# EasyEDA Pro project ProPrj_电容计量V2_2026-06-24.epro, schematic 贴片电容2
Board Name: 贴片电容2; Create Date: 2026-04-20; Page Name: P1; Project Name: 电容计量V2; Schematic Name: 贴片电容2; Update Date: 2026-04-20; Page Size: A4; Version: V1.0
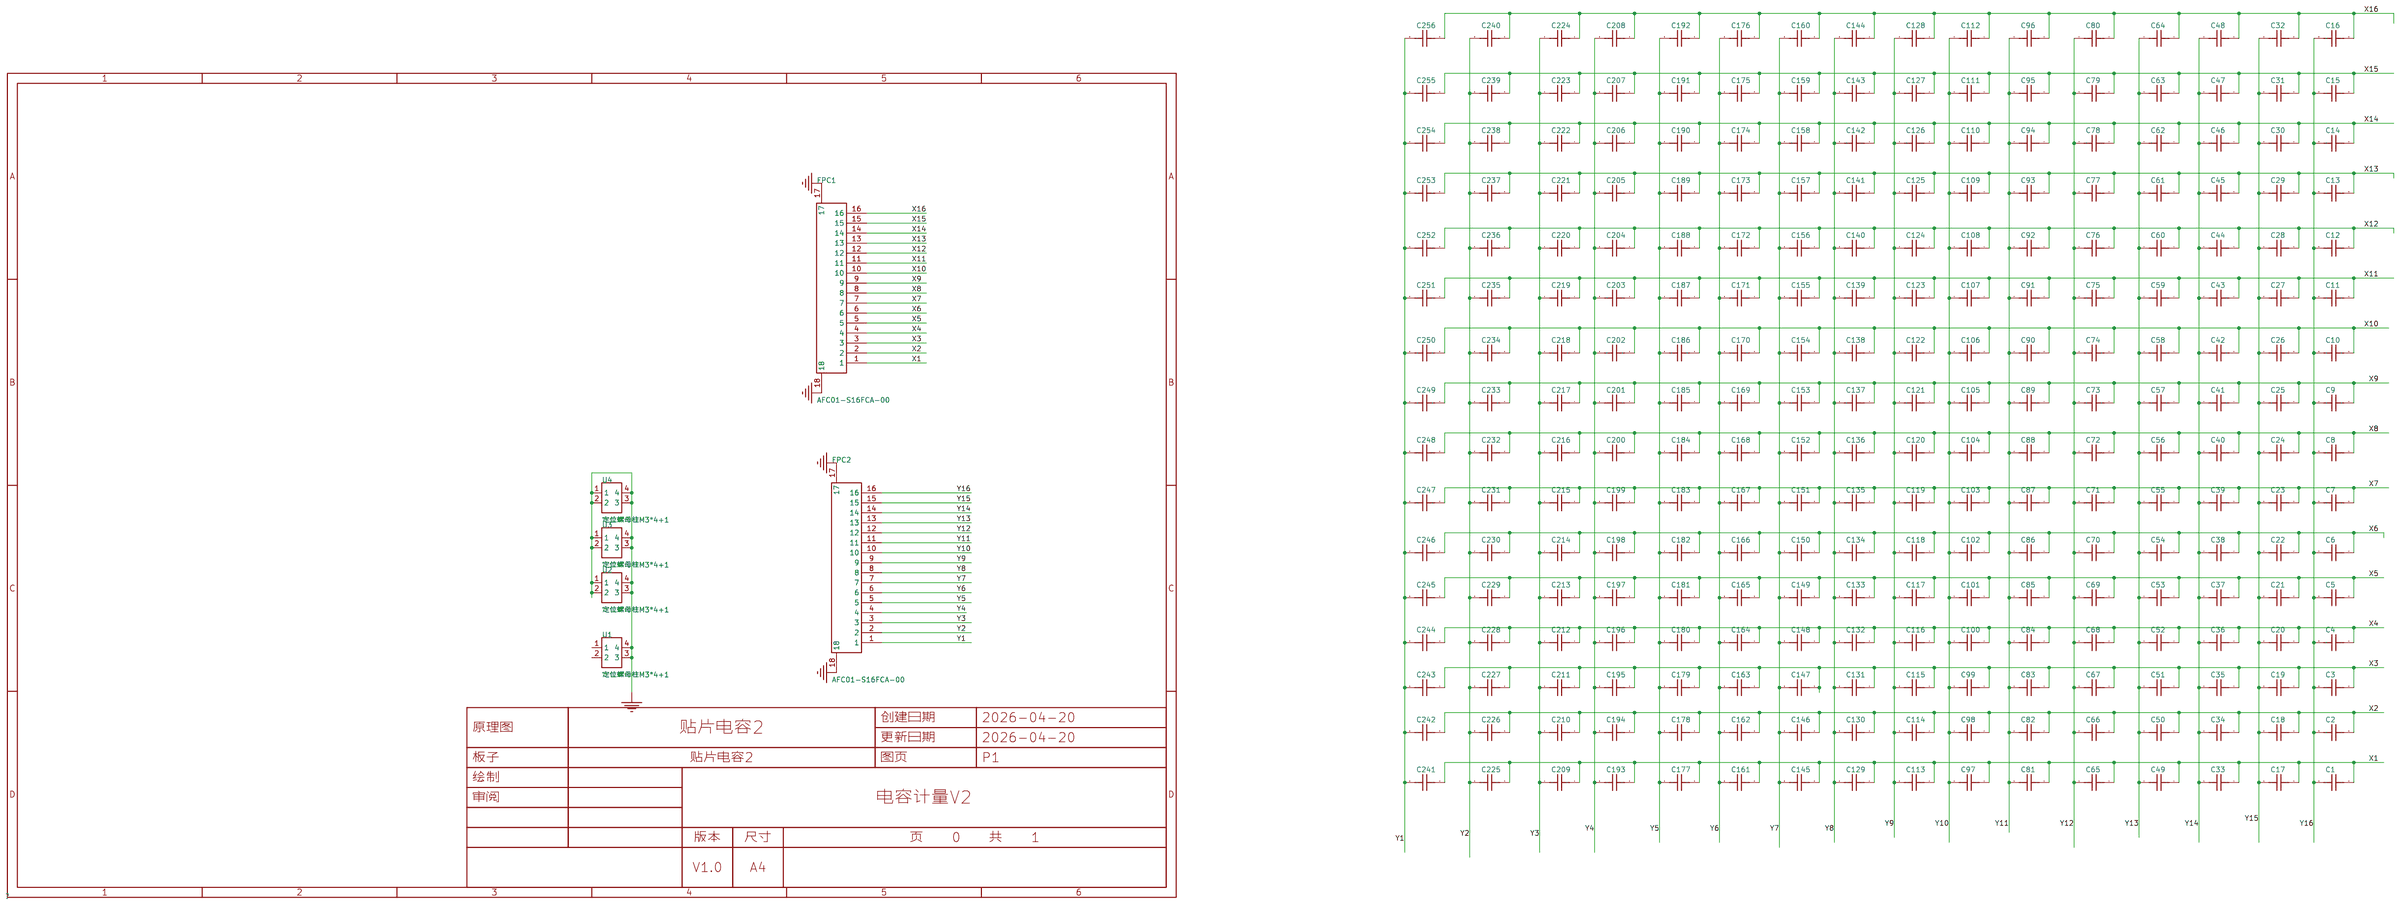
[diagram p10: schematic sheet]

## Parts
C1  C1608X6S1C225KTJ00E  [C0603]
C2  C1608X6S1C225KTJ00E  [C0603]
C3  C1608X6S1C225KTJ00E  [C0603]
C4  C1608X6S1C225KTJ00E  [C0603]
C5  C1608X6S1C225KTJ00E  [C0603]
C6  C1608X6S1C225KTJ00E  [C0603]
C7  C1608X6S1C225KTJ00E  [C0603]
C8  C1608X6S1C225KTJ00E  [C0603]
C9  C1608X6S1C225KTJ00E  [C0603]
C10  C1608X6S1C225KTJ00E  [C0603]
C11  C1608X6S1C225KTJ00E  [C0603]
C12  C1608X6S1C225KTJ00E  [C0603]
C13  C1608X6S1C225KTJ00E  [C0603]
C14  C1608X6S1C225KTJ00E  [C0603]
C15  C1608X6S1C225KTJ00E  [C0603]
C16  C1608X6S1C225KTJ00E  [C0603]
C17  C1608X6S1C225KTJ00E  [C0603]
C18  C1608X6S1C225KTJ00E  [C0603]
C19  C1608X6S1C225KTJ00E  [C0603]
C20  C1608X6S1C225KTJ00E  [C0603]
C21  C1608X6S1C225KTJ00E  [C0603]
C22  C1608X6S1C225KTJ00E  [C0603]
C23  C1608X6S1C225KTJ00E  [C0603]
C24  C1608X6S1C225KTJ00E  [C0603]
C25  C1608X6S1C225KTJ00E  [C0603]
C26  C1608X6S1C225KTJ00E  [C0603]
C27  C1608X6S1C225KTJ00E  [C0603]
C28  C1608X6S1C225KTJ00E  [C0603]
C29  C1608X6S1C225KTJ00E  [C0603]
C30  C1608X6S1C225KTJ00E  [C0603]
C31  C1608X6S1C225KTJ00E  [C0603]
C32  C1608X6S1C225KTJ00E  [C0603]
C33  C1608X6S1C225KTJ00E  [C0603]
C34  C1608X6S1C225KTJ00E  [C0603]
C35  C1608X6S1C225KTJ00E  [C0603]
C36  C1608X6S1C225KTJ00E  [C0603]
C37  C1608X6S1C225KTJ00E  [C0603]
C38  C1608X6S1C225KTJ00E  [C0603]
C39  C1608X6S1C225KTJ00E  [C0603]
C40  C1608X6S1C225KTJ00E  [C0603]
C41  C1608X6S1C225KTJ00E  [C0603]
C42  C1608X6S1C225KTJ00E  [C0603]
C43  C1608X6S1C225KTJ00E  [C0603]
C44  C1608X6S1C225KTJ00E  [C0603]
C45  C1608X6S1C225KTJ00E  [C0603]
C46  C1608X6S1C225KTJ00E  [C0603]
C47  C1608X6S1C225KTJ00E  [C0603]
C48  C1608X6S1C225KTJ00E  [C0603]
C49  C1608X6S1C225KTJ00E  [C0603]
C50  C1608X6S1C225KTJ00E  [C0603]
C51  C1608X6S1C225KTJ00E  [C0603]
C52  C1608X6S1C225KTJ00E  [C0603]
C53  C1608X6S1C225KTJ00E  [C0603]
C54  C1608X6S1C225KTJ00E  [C0603]
C55  C1608X6S1C225KTJ00E  [C0603]
C56  C1608X6S1C225KTJ00E  [C0603]
C57  C1608X6S1C225KTJ00E  [C0603]
C58  C1608X6S1C225KTJ00E  [C0603]
C59  C1608X6S1C225KTJ00E  [C0603]
C60  C1608X6S1C225KTJ00E  [C0603]
C61  C1608X6S1C225KTJ00E  [C0603]
C62  C1608X6S1C225KTJ00E  [C0603]
C63  C1608X6S1C225KTJ00E  [C0603]
C64  C1608X6S1C225KTJ00E  [C0603]
C65  C1608X6S1C225KTJ00E  [C0603]
C66  C1608X6S1C225KTJ00E  [C0603]
C67  C1608X6S1C225KTJ00E  [C0603]
C68  C1608X6S1C225KTJ00E  [C0603]
C69  C1608X6S1C225KTJ00E  [C0603]
C70  C1608X6S1C225KTJ00E  [C0603]
C71  C1608X6S1C225KTJ00E  [C0603]
C72  C1608X6S1C225KTJ00E  [C0603]
C73  C1608X6S1C225KTJ00E  [C0603]
C74  C1608X6S1C225KTJ00E  [C0603]
C75  C1608X6S1C225KTJ00E  [C0603]
C76  C1608X6S1C225KTJ00E  [C0603]
C77  C1608X6S1C225KTJ00E  [C0603]
C78  C1608X6S1C225KTJ00E  [C0603]
C79  C1608X6S1C225KTJ00E  [C0603]
C80  C1608X6S1C225KTJ00E  [C0603]
C81  C1608X6S1C225KTJ00E  [C0603]
C82  C1608X6S1C225KTJ00E  [C0603]
C83  C1608X6S1C225KTJ00E  [C0603]
C84  C1608X6S1C225KTJ00E  [C0603]
C85  C1608X6S1C225KTJ00E  [C0603]
C86  C1608X6S1C225KTJ00E  [C0603]
C87  C1608X6S1C225KTJ00E  [C0603]
C88  C1608X6S1C225KTJ00E  [C0603]
C89  C1608X6S1C225KTJ00E  [C0603]
C90  C1608X6S1C225KTJ00E  [C0603]
C91  C1608X6S1C225KTJ00E  [C0603]
C92  C1608X6S1C225KTJ00E  [C0603]
C93  C1608X6S1C225KTJ00E  [C0603]
C94  C1608X6S1C225KTJ00E  [C0603]
C95  C1608X6S1C225KTJ00E  [C0603]
C96  C1608X6S1C225KTJ00E  [C0603]
C97  C1608X6S1C225KTJ00E  [C0603]
C98  C1608X6S1C225KTJ00E  [C0603]
C99  C1608X6S1C225KTJ00E  [C0603]
C100  C1608X6S1C225KTJ00E  [C0603]
C101  C1608X6S1C225KTJ00E  [C0603]
C102  C1608X6S1C225KTJ00E  [C0603]
C103  C1608X6S1C225KTJ00E  [C0603]
C104  C1608X6S1C225KTJ00E  [C0603]
C105  C1608X6S1C225KTJ00E  [C0603]
C106  C1608X6S1C225KTJ00E  [C0603]
C107  C1608X6S1C225KTJ00E  [C0603]
C108  C1608X6S1C225KTJ00E  [C0603]
C109  C1608X6S1C225KTJ00E  [C0603]
C110  C1608X6S1C225KTJ00E  [C0603]
C111  C1608X6S1C225KTJ00E  [C0603]
C112  C1608X6S1C225KTJ00E  [C0603]
C113  C1608X6S1C225KTJ00E  [C0603]
C114  C1608X6S1C225KTJ00E  [C0603]
C115  C1608X6S1C225KTJ00E  [C0603]
C116  C1608X6S1C225KTJ00E  [C0603]
C117  C1608X6S1C225KTJ00E  [C0603]
C118  C1608X6S1C225KTJ00E  [C0603]
C119  C1608X6S1C225KTJ00E  [C0603]
C120  C1608X6S1C225KTJ00E  [C0603]
C121  C1608X6S1C225KTJ00E  [C0603]
C122  C1608X6S1C225KTJ00E  [C0603]
C123  C1608X6S1C225KTJ00E  [C0603]
C124  C1608X6S1C225KTJ00E  [C0603]
C125  C1608X6S1C225KTJ00E  [C0603]
C126  C1608X6S1C225KTJ00E  [C0603]
C127  C1608X6S1C225KTJ00E  [C0603]
C128  C1608X6S1C225KTJ00E  [C0603]
C129  C1608X6S1C225KTJ00E  [C0603]
C130  C1608X6S1C225KTJ00E  [C0603]
C131  C1608X6S1C225KTJ00E  [C0603]
C132  C1608X6S1C225KTJ00E  [C0603]
C133  C1608X6S1C225KTJ00E  [C0603]
C134  C1608X6S1C225KTJ00E  [C0603]
C135  C1608X6S1C225KTJ00E  [C0603]
C136  C1608X6S1C225KTJ00E  [C0603]
C137  C1608X6S1C225KTJ00E  [C0603]
C138  C1608X6S1C225KTJ00E  [C0603]
C139  C1608X6S1C225KTJ00E  [C0603]
C140  C1608X6S1C225KTJ00E  [C0603]
C141  C1608X6S1C225KTJ00E  [C0603]
C142  C1608X6S1C225KTJ00E  [C0603]
C143  C1608X6S1C225KTJ00E  [C0603]
C144  C1608X6S1C225KTJ00E  [C0603]
C145  C1608X6S1C225KTJ00E  [C0603]
C146  C1608X6S1C225KTJ00E  [C0603]
C147  C1608X6S1C225KTJ00E  [C0603]
C148  C1608X6S1C225KTJ00E  [C0603]
C149  C1608X6S1C225KTJ00E  [C0603]
C150  C1608X6S1C225KTJ00E  [C0603]
C151  C1608X6S1C225KTJ00E  [C0603]
C152  C1608X6S1C225KTJ00E  [C0603]
C153  C1608X6S1C225KTJ00E  [C0603]
C154  C1608X6S1C225KTJ00E  [C0603]
C155  C1608X6S1C225KTJ00E  [C0603]
C156  C1608X6S1C225KTJ00E  [C0603]
C157  C1608X6S1C225KTJ00E  [C0603]
C158  C1608X6S1C225KTJ00E  [C0603]
C159  C1608X6S1C225KTJ00E  [C0603]
C160  C1608X6S1C225KTJ00E  [C0603]
C161  C1608X6S1C225KTJ00E  [C0603]
C162  C1608X6S1C225KTJ00E  [C0603]
C163  C1608X6S1C225KTJ00E  [C0603]
C164  C1608X6S1C225KTJ00E  [C0603]
C165  C1608X6S1C225KTJ00E  [C0603]
C166  C1608X6S1C225KTJ00E  [C0603]
C167  C1608X6S1C225KTJ00E  [C0603]
C168  C1608X6S1C225KTJ00E  [C0603]
C169  C1608X6S1C225KTJ00E  [C0603]
C170  C1608X6S1C225KTJ00E  [C0603]
C171  C1608X6S1C225KTJ00E  [C0603]
C172  C1608X6S1C225KTJ00E  [C0603]
C173  C1608X6S1C225KTJ00E  [C0603]
C174  C1608X6S1C225KTJ00E  [C0603]
C175  C1608X6S1C225KTJ00E  [C0603]
C176  C1608X6S1C225KTJ00E  [C0603]
C177  C1608X6S1C225KTJ00E  [C0603]
C178  C1608X6S1C225KTJ00E  [C0603]
C179  C1608X6S1C225KTJ00E  [C0603]
C180  C1608X6S1C225KTJ00E  [C0603]
C181  C1608X6S1C225KTJ00E  [C0603]
C182  C1608X6S1C225KTJ00E  [C0603]
C183  C1608X6S1C225KTJ00E  [C0603]
C184  C1608X6S1C225KTJ00E  [C0603]
C185  C1608X6S1C225KTJ00E  [C0603]
C186  C1608X6S1C225KTJ00E  [C0603]
C187  C1608X6S1C225KTJ00E  [C0603]
C188  C1608X6S1C225KTJ00E  [C0603]
C189  C1608X6S1C225KTJ00E  [C0603]
C190  C1608X6S1C225KTJ00E  [C0603]
C191  C1608X6S1C225KTJ00E  [C0603]
C192  C1608X6S1C225KTJ00E  [C0603]
C193  C1608X6S1C225KTJ00E  [C0603]
C194  C1608X6S1C225KTJ00E  [C0603]
C195  C1608X6S1C225KTJ00E  [C0603]
C196  C1608X6S1C225KTJ00E  [C0603]
C197  C1608X6S1C225KTJ00E  [C0603]
C198  C1608X6S1C225KTJ00E  [C0603]
C199  C1608X6S1C225KTJ00E  [C0603]
C200  C1608X6S1C225KTJ00E  [C0603]
C201  C1608X6S1C225KTJ00E  [C0603]
C202  C1608X6S1C225KTJ00E  [C0603]
C203  C1608X6S1C225KTJ00E  [C0603]
C204  C1608X6S1C225KTJ00E  [C0603]
C205  C1608X6S1C225KTJ00E  [C0603]
C206  C1608X6S1C225KTJ00E  [C0603]
C207  C1608X6S1C225KTJ00E  [C0603]
C208  C1608X6S1C225KTJ00E  [C0603]
C209  C1608X6S1C225KTJ00E  [C0603]
C210  C1608X6S1C225KTJ00E  [C0603]
C211  C1608X6S1C225KTJ00E  [C0603]
C212  C1608X6S1C225KTJ00E  [C0603]
C213  C1608X6S1C225KTJ00E  [C0603]
C214  C1608X6S1C225KTJ00E  [C0603]
C215  C1608X6S1C225KTJ00E  [C0603]
C216  C1608X6S1C225KTJ00E  [C0603]
C217  C1608X6S1C225KTJ00E  [C0603]
C218  C1608X6S1C225KTJ00E  [C0603]
C219  C1608X6S1C225KTJ00E  [C0603]
C220  C1608X6S1C225KTJ00E  [C0603]
C221  C1608X6S1C225KTJ00E  [C0603]
C222  C1608X6S1C225KTJ00E  [C0603]
C223  C1608X6S1C225KTJ00E  [C0603]
C224  C1608X6S1C225KTJ00E  [C0603]
C225  C1608X6S1C225KTJ00E  [C0603]
C226  C1608X6S1C225KTJ00E  [C0603]
C227  C1608X6S1C225KTJ00E  [C0603]
C228  C1608X6S1C225KTJ00E  [C0603]
C229  C1608X6S1C225KTJ00E  [C0603]
C230  C1608X6S1C225KTJ00E  [C0603]
C231  C1608X6S1C225KTJ00E  [C0603]
C232  C1608X6S1C225KTJ00E  [C0603]
C233  C1608X6S1C225KTJ00E  [C0603]
C234  C1608X6S1C225KTJ00E  [C0603]
C235  C1608X6S1C225KTJ00E  [C0603]
C236  C1608X6S1C225KTJ00E  [C0603]
C237  C1608X6S1C225KTJ00E  [C0603]
C238  C1608X6S1C225KTJ00E  [C0603]
C239  C1608X6S1C225KTJ00E  [C0603]
C240  C1608X6S1C225KTJ00E  [C0603]
C241  C1608X6S1C225KTJ00E  [C0603]
C242  C1608X6S1C225KTJ00E  [C0603]
C243  C1608X6S1C225KTJ00E  [C0603]
C244  C1608X6S1C225KTJ00E  [C0603]
C245  C1608X6S1C225KTJ00E  [C0603]
C246  C1608X6S1C225KTJ00E  [C0603]
C247  C1608X6S1C225KTJ00E  [C0603]
C248  C1608X6S1C225KTJ00E  [C0603]
C249  C1608X6S1C225KTJ00E  [C0603]
C250  C1608X6S1C225KTJ00E  [C0603]
C251  C1608X6S1C225KTJ00E  [C0603]
C252  C1608X6S1C225KTJ00E  [C0603]
C253  C1608X6S1C225KTJ00E  [C0603]
C254  C1608X6S1C225KTJ00E  [C0603]
C255  C1608X6S1C225KTJ00E  [C0603]
C256  C1608X6S1C225KTJ00E  [C0603]
FPC1  AFC01-S16FCA-00  [FPC-SMD_P0.50-16P_FGS-XJ-H2.0]
FPC2  AFC01-S16FCA-00  [FPC-SMD_P0.50-16P_FGS-XJ-H2.0]
U1  定位螺母柱M3*4+1  [SMD_BD4.5-L4.5-W4.5-D0.8]
U2  定位螺母柱M3*4+1  [SMD_BD4.5-L4.5-W4.5-D0.8]
U3  定位螺母柱M3*4+1  [SMD_BD4.5-L4.5-W4.5-D0.8]
U4  定位螺母柱M3*4+1  [SMD_BD4.5-L4.5-W4.5-D0.8]

## Library data of the parts
C1-C256 = C1608X6S1C225KTJ00E: Supplier Part: C342995; Manufacturer: TDK; Supplier Footprint: 0603; Datasheet: https://item.szlcsc.com/datasheet/C1608X6S1C225KTJ00E/319845.html; Supplier: LCSC
FPC1 FPC2 = AFC01-S16FCA-00: 锁定特性:翻盖式;触点类型:下接;触点数量:16P;间距:0.5mm;安装类型:卧贴;; LCSC Part Name: 间距:0.5mm P数:16P 翻盖式 下接; Supplier Part: C262665; Manufacturer: JS(钜硕电子); Supplier Footprint: SMD,P=0.5mm,卧贴; JLCPCB Part Class: 扩展库; Datasheet: https://atta.szlcsc.com/upload/public/pdf/source/20190816/C413942_2A72D1AC756EAE17EEDF756A339D4500.pdf; Supplier: LCSC; Locking Feature: 翻盖式; Contact Type: 下接; Number of Contacts: 16P; Pitch: 0.5mm; Mounting Type: 卧贴; FFC, FCB Thickness: 0.3mm; Height Above Board: 2mm
U1-U4 = 定位螺母柱M3*4+1: Supplier Part: C9900018484; Supplier Footprint: DOT1; JLCPCB Part Class: Extended Part; Supplier: LCSC

## Nets
GND: FPC1.17 FPC1.18 FPC2.17 FPC2.18 U1.3 U1.4 U2.1 U2.2 U2.3 U2.4 U3.1 U3.2 U3.3 U3.4 U4.1 U4.2 U4.3 U4.4
X1: C1.1 C17.1 C33.1 C49.1 C65.1 C81.1 C97.1 C113.1 C129.1 C145.1 C161.1 C177.1 C193.1 C209.1 C225.1 C241.1 FPC1.1
X2: C2.1 C18.1 C34.1 C50.1 C66.1 C82.1 C98.1 C114.1 C130.1 C146.1 C162.1 C178.1 C194.1 C210.1 C226.1 C242.1 FPC1.2
X3: C3.1 C19.1 C35.1 C51.1 C67.1 C83.1 C99.1 C115.1 C131.1 C147.1 C163.1 C179.1 C195.1 C211.1 C227.1 C243.1 FPC1.3
X4: C4.1 C20.1 C36.1 C52.1 C68.1 C84.1 C100.1 C116.1 C132.1 C148.1 C164.1 C180.1 C196.1 C212.1 C228.1 C244.1 FPC1.4
X5: C5.1 C21.1 C37.1 C53.1 C69.1 C85.1 C101.1 C117.1 C133.1 C149.1 C165.1 C181.1 C197.1 C213.1 C229.1 C245.1 FPC1.5
X6: C6.1 C22.1 C38.1 C54.1 C70.1 C86.1 C102.1 C118.1 C134.1 C150.1 C166.1 C182.1 C198.1 C214.1 C230.1 C246.1 FPC1.6
X7: C7.1 C23.1 C39.1 C55.1 C71.1 C87.1 C103.1 C119.1 C135.1 C151.1 C167.1 C183.1 C199.1 C215.1 C231.1 C247.1 FPC1.7
X8: C8.1 C24.1 C40.1 C56.1 C72.1 C88.1 C104.1 C120.1 C136.1 C152.1 C168.1 C184.1 C200.1 C216.1 C232.1 C248.1 FPC1.8
X9: C9.1 C25.1 C41.1 C57.1 C73.1 C89.1 C105.1 C121.1 C137.1 C153.1 C169.1 C185.1 C201.1 C217.1 C233.1 C249.1 FPC1.9
X10: C10.1 C26.1 C42.1 C58.1 C74.1 C90.1 C106.1 C122.1 C138.1 C154.1 C170.1 C186.1 C202.1 C218.1 C234.1 C250.1 FPC1.10
X11: C11.1 C27.1 C43.1 C59.1 C75.1 C91.1 C107.1 C123.1 C139.1 C155.1 C171.1 C187.1 C203.1 C219.1 C235.1 C251.1 FPC1.11
X12: C12.1 C28.1 C44.1 C60.1 C76.1 C92.1 C108.1 C124.1 C140.1 C156.1 C172.1 C188.1 C204.1 C220.1 C236.1 C252.1 FPC1.12
X13: C13.1 C29.1 C45.1 C61.1 C77.1 C93.1 C109.1 C125.1 C141.1 C157.1 C173.1 C189.1 C205.1 C221.1 C237.1 C253.1 FPC1.13
X14: C14.1 C30.1 C46.1 C62.1 C78.1 C94.1 C110.1 C126.1 C142.1 C158.1 C174.1 C190.1 C206.1 C222.1 C238.1 C254.1 FPC1.14
X15: C15.1 C31.1 C47.1 C63.1 C79.1 C95.1 C111.1 C127.1 C143.1 C159.1 C175.1 C191.1 C207.1 C223.1 C239.1 C255.1 FPC1.15
X16: C16.1 C32.1 C48.1 C64.1 C80.1 C96.1 C112.1 C128.1 C144.1 C160.1 C176.1 C192.1 C208.1 C224.1 C240.1 C256.1 FPC1.16
Y1: C241.2 C242.2 C243.2 C244.2 C245.2 C246.2 C247.2 C248.2 C249.2 C250.2 C251.2 C252.2 C253.2 C254.2 C255.2 C256.2 FPC2.1
Y2: C225.2 C226.2 C227.2 C228.2 C229.2 C230.2 C231.2 C232.2 C233.2 C234.2 C235.2 C236.2 C237.2 C238.2 C239.2 C240.2 FPC2.2
Y3: C209.2 C210.2 C211.2 C212.2 C213.2 C214.2 C215.2 C216.2 C217.2 C218.2 C219.2 C220.2 C221.2 C222.2 C223.2 C224.2 FPC2.3
Y4: C193.2 C194.2 C195.2 C196.2 C197.2 C198.2 C199.2 C200.2 C201.2 C202.2 C203.2 C204.2 C205.2 C206.2 C207.2 C208.2 FPC2.4
Y5: C177.2 C178.2 C179.2 C180.2 C181.2 C182.2 C183.2 C184.2 C185.2 C186.2 C187.2 C188.2 C189.2 C190.2 C191.2 C192.2 FPC2.5
Y6: C161.2 C162.2 C163.2 C164.2 C165.2 C166.2 C167.2 C168.2 C169.2 C170.2 C171.2 C172.2 C173.2 C174.2 C175.2 C176.2 FPC2.6
Y7: C145.2 C146.2 C147.2 C148.2 C149.2 C150.2 C151.2 C152.2 C153.2 C154.2 C155.2 C156.2 C157.2 C158.2 C159.2 C160.2 FPC2.7
Y8: C129.2 C130.2 C131.2 C132.2 C133.2 C134.2 C135.2 C136.2 C137.2 C138.2 C139.2 C140.2 C141.2 C142.2 C143.2 C144.2 FPC2.8
Y9: C113.2 C114.2 C115.2 C116.2 C117.2 C118.2 C119.2 C120.2 C121.2 C122.2 C123.2 C124.2 C125.2 C126.2 C127.2 C128.2 FPC2.9
Y10: C97.2 C98.2 C99.2 C100.2 C101.2 C102.2 C103.2 C104.2 C105.2 C106.2 C107.2 C108.2 C109.2 C110.2 C111.2 C112.2 FPC2.10
Y11: C81.2 C82.2 C83.2 C84.2 C85.2 C86.2 C87.2 C88.2 C89.2 C90.2 C91.2 C92.2 C93.2 C94.2 C95.2 C96.2 FPC2.11
Y12: C65.2 C66.2 C67.2 C68.2 C69.2 C70.2 C71.2 C72.2 C73.2 C74.2 C75.2 C76.2 C77.2 C78.2 C79.2 C80.2 FPC2.12
Y13: C49.2 C50.2 C51.2 C52.2 C53.2 C54.2 C55.2 C56.2 C57.2 C58.2 C59.2 C60.2 C61.2 C62.2 C63.2 C64.2 FPC2.13
Y14: C33.2 C34.2 C35.2 C36.2 C37.2 C38.2 C39.2 C40.2 C41.2 C42.2 C43.2 C44.2 C45.2 C46.2 C47.2 C48.2 FPC2.14
Y15: C17.2 C18.2 C19.2 C20.2 C21.2 C22.2 C23.2 C24.2 C25.2 C26.2 C27.2 C28.2 C29.2 C30.2 C31.2 C32.2 FPC2.15
Y16: C1.2 C2.2 C3.2 C4.2 C5.2 C6.2 C7.2 C8.2 C9.2 C10.2 C11.2 C12.2 C13.2 C14.2 C15.2 C16.2 FPC2.16

Not connected (* = marked no-connect by the designer): U1 1 2
